# Altium schematic sheet USB to UART With Zigbee V1.0.SchDoc
size A4
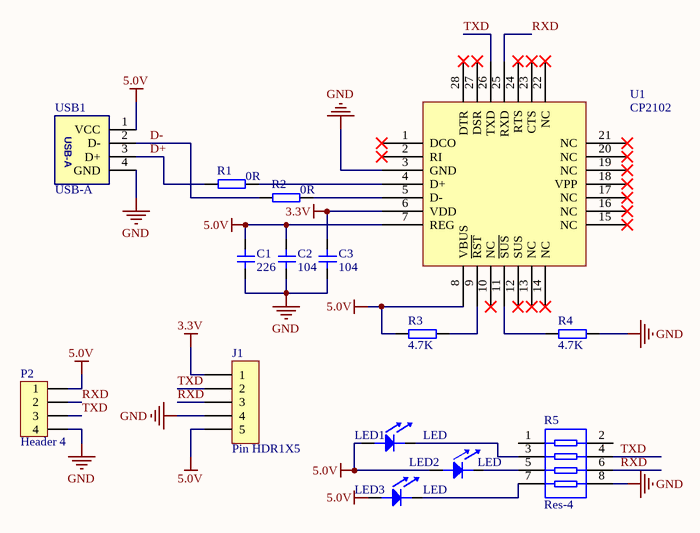
[diagram p0: USB to UART With Zigbee V1.0.SchDoc]

## Parts
C1  226  [0805C]
C2  104  [0805C]
C3  104  [0805C]
J1  Pin HDR1X5  [Pin HDR1X5/2mm-W]
LED1  LED  [0805LED(GREEN)]
LED2  LED  [0805LED(GREEN)]
LED3  LED  [0805LED(GREEN)]
P2  Header 4  [Header 4(排母)]
R1  0R  [0805R]
R2  0R  [0805R]
R3  4.7K  [0805R]
R4  4.7K  [0805R]
R5  Res-4  [排阻(4位贴片)]
U1  CP2102  [QFN-28]
USB1  USB-A  [USB_A/P_B]

## Nets
3.3V: C3.2 J1.1 U1.6(VDD)
5.0V: C1.2 C2.2 J1.5 LED1.1 LED2.1 LED3.1 P2.1 R3.2 U1.7(REG) U1.8(VBUS) USB1.1(VCC)
GND: C1.1 C2.1 C3.1 J1.4 P2.4 R4.1 R5.8 U1.3(GND) USB1.4(GND)
D+: R1.1 USB1.3(D+)
D-: R2.1 USB1.2(D-)
RXD: J1.3 P2.2 R5.6 U1.25(RXD)
TXD: J1.2 P2.3 R5.4 U1.26(TXD)
NetLED1_2: LED1.2 R5.3
NetLED2_2: LED2.2 R5.5
NetLED3_2: LED3.2 R5.7
NetR1_2: R1.2 U1.4(D+)
NetR2_2: R2.2 U1.5(D-)
NetR3_1: R3.1 U1.9(~{RST})
NetR4_2: R4.2 U1.11(~{SUS})

Not connected (* = marked no-connect by the designer): R5 1 2; U1 1(DCO)* 2(RI)* 10(NC)* 12(SUS)* 13(NC)* 14(NC)* 15(NC)* 16(NC)* 17(NC)* 18(VPP)* 19(NC)* 20(NC)* 21(NC)* 22(NC)* 23(CTS)* 24(RTS)* 27(DSR)* 28(DTR)*

## Library data of the parts
C1-C3 = Cap1: 无极贴片电容
LED1-LED3 = LED: 发光二极管
P2 = Header 4: 排针
R1-R4 = Res: 电阻
R5 = Res-4: 排阻
U1 = CP2102: USB转串口芯片; Rule: PcbType=ProtelPcb